# Altium schematic sheet Interface.SchDoc
size A3; SheetNumber: 1; SheetTotal: 9
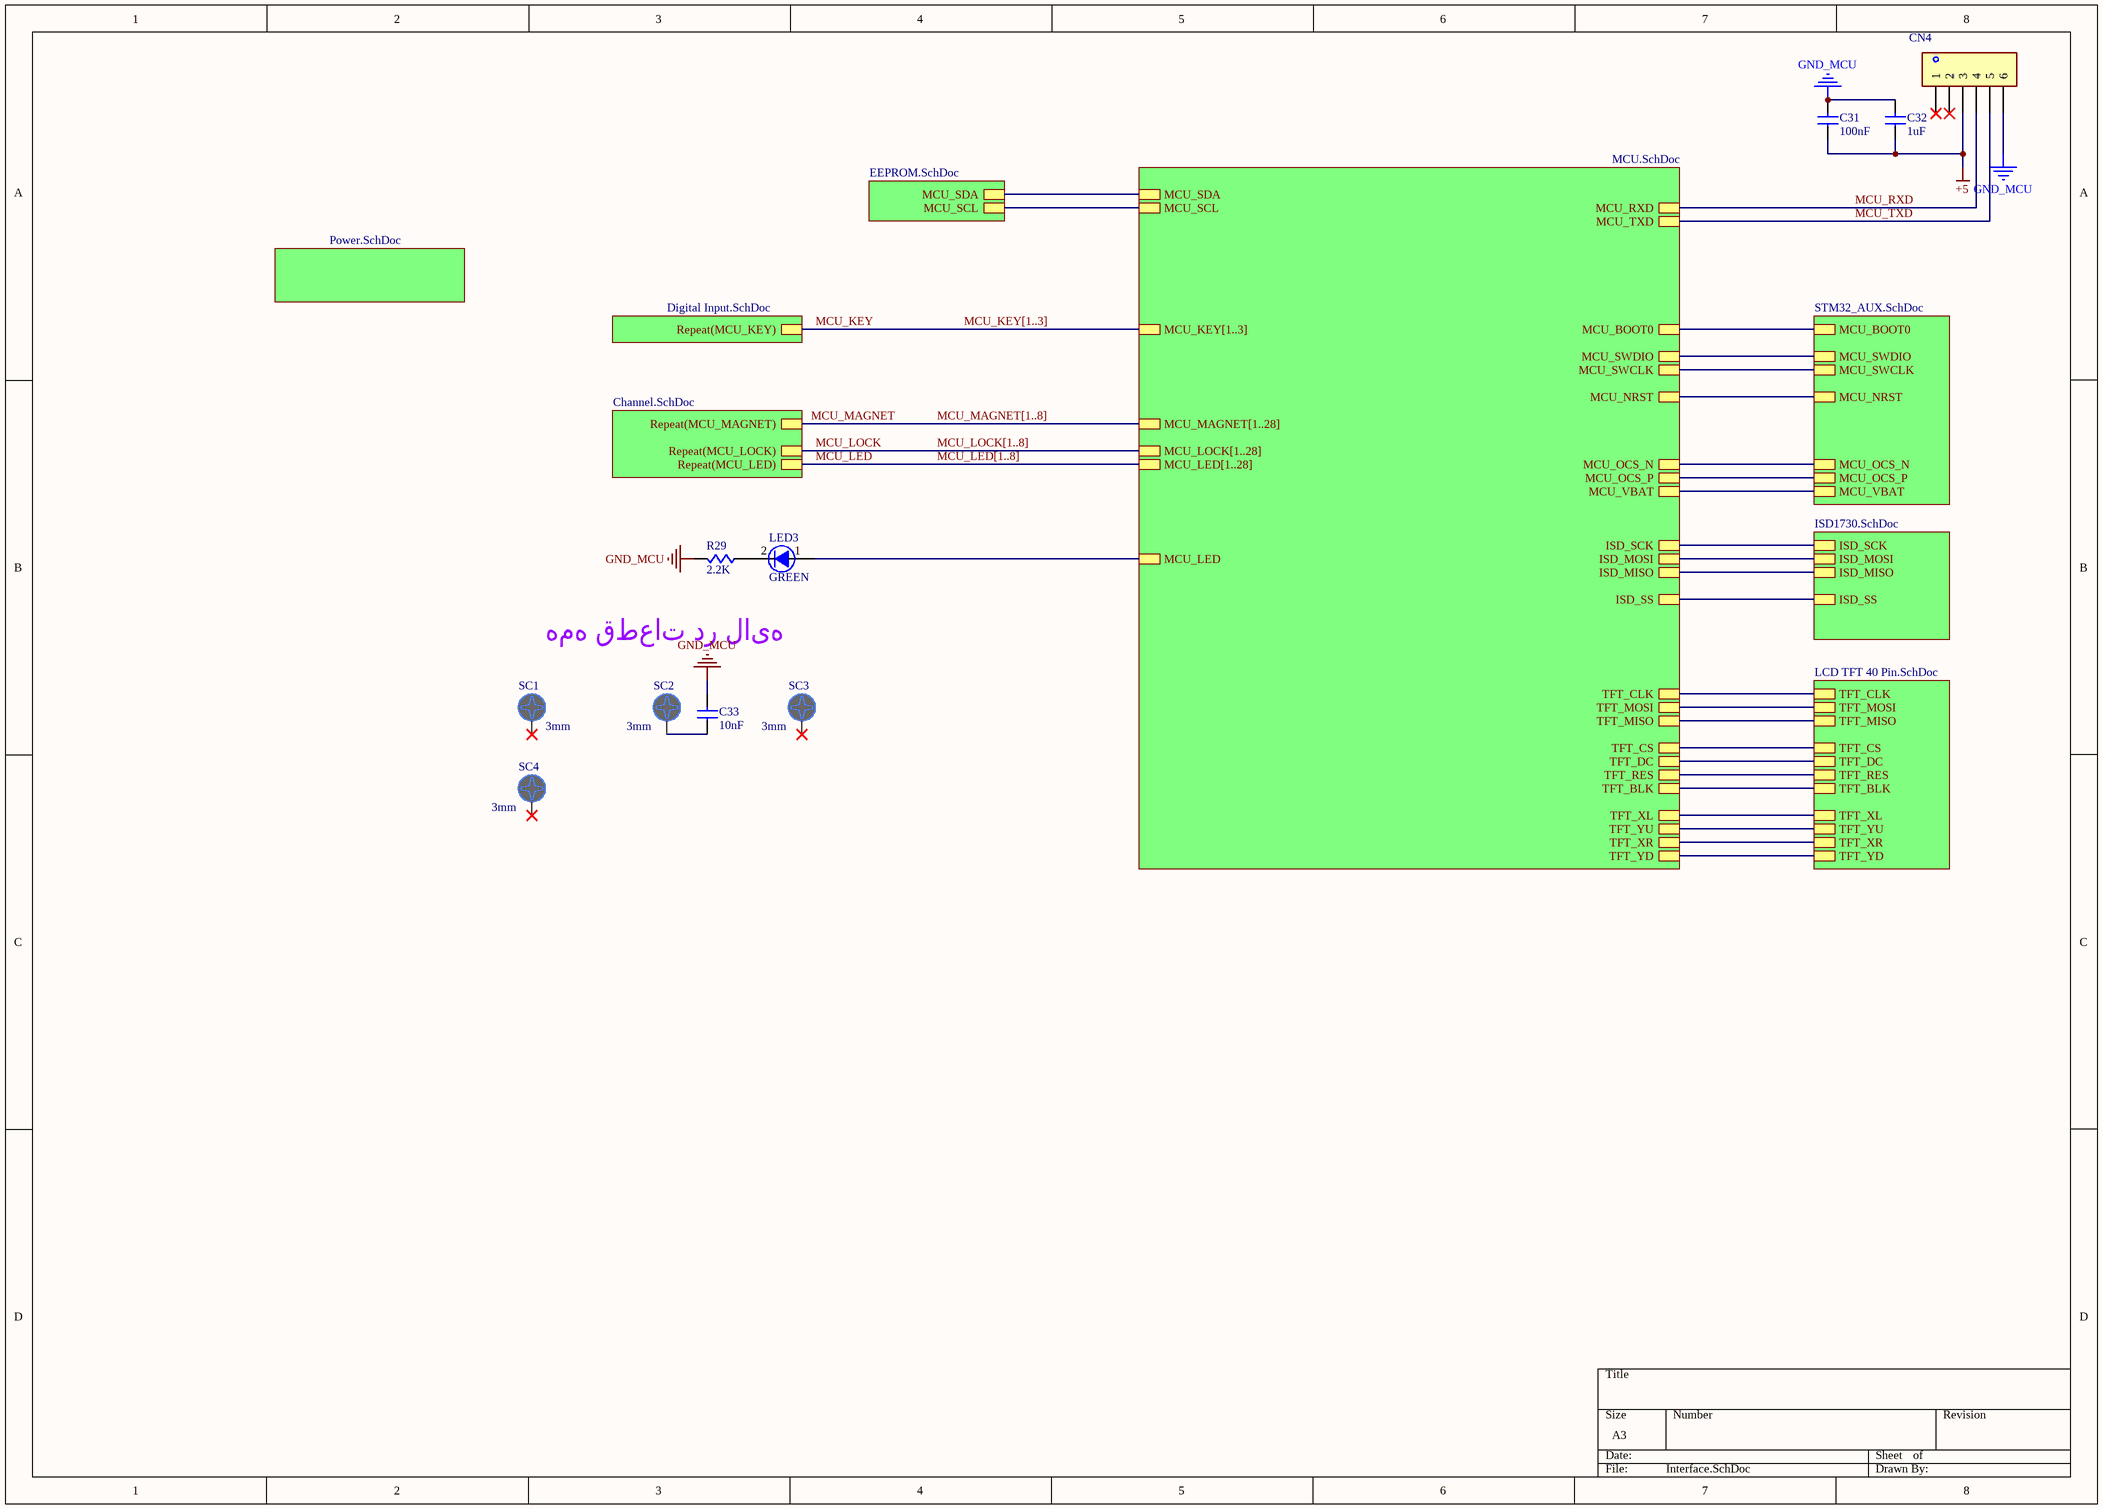
[diagram p0: Interface.SchDoc]

## Parts
C31  value 100nF  [C-0805]  (hidden comment: CAP Cer 100nF-50V-X7R-SMD)
C32  value 1uF  [C-0805]  (hidden comment: CAP Cer 1uF-50V-X7R-SMD)
C33  value 10nF  [CAP-CER-7x2.5-Ls5]  (hidden comment: CAP Cer 10nF-1KV-X7R-THD)
CN4  Connector XH-Straight-THD-2.54mm  [XH-6]  (value not drawn)
LED3  Color: GREEN  [LED-1206-Y]  (hidden comment: LED GREEN-1206-SMD)
R29  value 2.2K  [R-0805]  (hidden comment: RES 2.2K-5%-1/8W-SMD)
SC1  Size: 3mm  [Screw_M3]  (hidden comment: Screw 3mm)
SC2  Size: 3mm  [Screw_M3]  (hidden comment: Screw 3mm)
SC3  Size: 3mm  [Screw_M3]  (hidden comment: Screw 3mm)
SC4  Size: 3mm  [Screw_M3]  (hidden comment: Screw 3mm)

## Sub-sheets
EEPROM = EEPROM.SchDoc: MCU_SDA, MCU_SCL
ISD1730 = ISD1730.SchDoc: ISD_SCK, ISD_MOSI, ISD_MISO, ISD_SS
MCU = MCU.SchDoc: MCU_BOOT0, MCU_SWCLK, MCU_SWDIO, MCU_NRST, MCU_OCS_N, MCU_OCS_P, TFT_CS, TFT_CLK, TFT_DC, TFT_MOSI, TFT_MISO, TFT_RES, TFT_BLK, ISD_SCK, ISD_MOSI, ISD_MISO, ISD_SS, MCU_SDA, MCU_SCL, MCU_KEY[1..3], MCU_LOCK[1..28], MCU_LED[1..28], MCU_MAGNET[1..28], MCU_TXD, MCU_RXD, MCU_VBAT, TFT_XL, TFT_YU, TFT_XR, TFT_YD, MCU_LED
Power = Power.SchDoc: no entries
Repeat(CHANNEL, 1, 8) = Channel.SchDoc: Repeat(MCU_LOCK), Repeat(MCU_LED), Repeat(MCU_MAGNET)
Repeat(KEY, 1, 3) = Digital Input.SchDoc: Repeat(MCU_KEY)
STM_AUX = STM32_AUX.SchDoc: MCU_BOOT0, MCU_SWCLK, MCU_SWDIO, MCU_NRST, MCU_OCS_N, MCU_OCS_P, MCU_VBAT
TFT = LCD TFT 40 Pin.SchDoc: TFT_CS, TFT_CLK, TFT_DC, TFT_MOSI, TFT_MISO, TFT_RES, TFT_BLK, TFT_XL, TFT_YU, TFT_XR, TFT_YD

## Nets
+5: C31.1 C32.1 CN4.3
GND_MCU: C31.2 C32.2 C33.2 CN4.6 R29.2
MCU_KEY: sheet Repeat(KEY, 1, 3)/Repeat(MCU_KEY)  [also labelled MCU_KEY[1..3]]
MCU_LED: sheet Repeat(CHANNEL, 1, 8)/Repeat(MCU_LED)
MCU_LOCK: sheet Repeat(CHANNEL, 1, 8)/Repeat(MCU_LOCK)
MCU_MAGNET: sheet Repeat(CHANNEL, 1, 8)/Repeat(MCU_MAGNET)
MCU_RXD: CN4.4 ; sheet MCU/MCU_RXD
MCU_TXD: CN4.5 ; sheet MCU/MCU_TXD
NetC33_1: C33.1 SC2.1
NetLED3_1: LED3.1(A) ; sheet MCU/MCU_LED
NetLED3_2: LED3.2(C) R29.1
(unnamed): sheet MCU/MCU_BOOT0, sheet STM_AUX/MCU_BOOT0
(unnamed): sheet MCU/MCU_SWCLK, sheet STM_AUX/MCU_SWCLK
(unnamed): sheet MCU/MCU_SWDIO, sheet STM_AUX/MCU_SWDIO
(unnamed): sheet MCU/MCU_NRST, sheet STM_AUX/MCU_NRST
(unnamed): sheet MCU/MCU_OCS_N, sheet STM_AUX/MCU_OCS_N
(unnamed): sheet MCU/MCU_OCS_P, sheet STM_AUX/MCU_OCS_P
(unnamed): sheet MCU/TFT_CS, sheet TFT/TFT_CS
(unnamed): sheet MCU/TFT_CLK, sheet TFT/TFT_CLK
(unnamed): sheet MCU/TFT_DC, sheet TFT/TFT_DC
(unnamed): sheet MCU/TFT_MOSI, sheet TFT/TFT_MOSI
(unnamed): sheet MCU/TFT_MISO, sheet TFT/TFT_MISO
(unnamed): sheet MCU/TFT_RES, sheet TFT/TFT_RES
(unnamed): sheet MCU/TFT_BLK, sheet TFT/TFT_BLK
(unnamed): sheet MCU/ISD_SCK, sheet ISD1730/ISD_SCK
(unnamed): sheet MCU/ISD_MOSI, sheet ISD1730/ISD_MOSI
(unnamed): sheet MCU/ISD_MISO, sheet ISD1730/ISD_MISO
(unnamed): sheet MCU/ISD_SS, sheet ISD1730/ISD_SS
(unnamed): sheet MCU/MCU_SDA, sheet EEPROM/MCU_SDA
(unnamed): sheet MCU/MCU_SCL, sheet EEPROM/MCU_SCL
(unnamed): sheet MCU/MCU_VBAT, sheet STM_AUX/MCU_VBAT
(unnamed): sheet MCU/TFT_XL, sheet TFT/TFT_XL
(unnamed): sheet MCU/TFT_YU, sheet TFT/TFT_YU
(unnamed): sheet MCU/TFT_XR, sheet TFT/TFT_XR
(unnamed): sheet MCU/TFT_YD, sheet TFT/TFT_YD

Not connected (* = marked no-connect by the designer): CN4 1* 2*; SC1 1*; SC3 1*; SC4 1*

## Buses and harness runs
bus MCU_LED[1..8] = sheet MCU/MCU_LED[1..28]
bus MCU_LOCK[1..8] = sheet MCU/MCU_LOCK[1..28]
bus MCU_MAGNET[1..8] = sheet MCU/MCU_MAGNET[1..28]

## Notes on the sheet
- همه قطعات در لایه بالا قرار بگیرند

## Library data of the parts
C31 C32 = CAP-CER: CAPACITOR; Phone Number: 0915 8700 314; Voltage: 50V; Tolerance: X7R; Type: SMD; Publisher: Mahdi Bagherzadeh; ComponentLink1Description: Linkedin; ComponentLink1URL: https://ir.linkedin.com/in/mahdi-bagherzade; Published Date: 9-15-2024
C33 = CAP-CER: CAPACITOR; Phone Number: 0915 8700 314; Voltage: 1KV; Tolerance: X7R; Type: THD; Publisher: Mahdi Bagherzadeh; ComponentLink1Description: Linkedin; ComponentLink1URL: https://ir.linkedin.com/in/mahdi-bagherzade; Published Date: 9-15-2024
CN4 = CN-6pin: CONNECTOR; Phone Number: 0915 8700 314; Value: XH; Publisher: Mahdi Bagherzadeh; ComponentLink1Description: Linkedin; ComponentLink1URL: https://ir.linkedin.com/in/mahdi-bagherzade; Published Date: 9-15-2024; Size: 2.54mm; Type: Straight-THD
LED3 = LED: Phone Number: 0915 8700 314; Type: SMD; Publisher: Mahdi Bagherzadeh; ComponentLink1Description: Linkedin; ComponentLink1URL: https://ir.linkedin.com/in/mahdi-bagherzade; Published Date: 9-15-2024; Size: 1206
R29 = RES: RESISTOR; Phone Number: 0915 8700 314; Tolerance: 5%; Power: 1/8W; Publisher: Mahdi Bagherzadeh; ComponentLink1Description: Linkedin; ComponentLink1URL: https://ir.linkedin.com/in/mahdi-bagherzade; Published Date: 9-15-2024; Type: SMD
SC1-SC4 = SCREW: Phone Number: 0915 8700 314; Publisher: Mahdi Bagherzadeh; ComponentLink1Description: Linkedin; ComponentLink1URL: https://ir.linkedin.com/in/mahdi-bagherzade; Published Date: 9-15-2024